# EAGLE design esp8266-01 carrier (EAGLE 9.3.2)
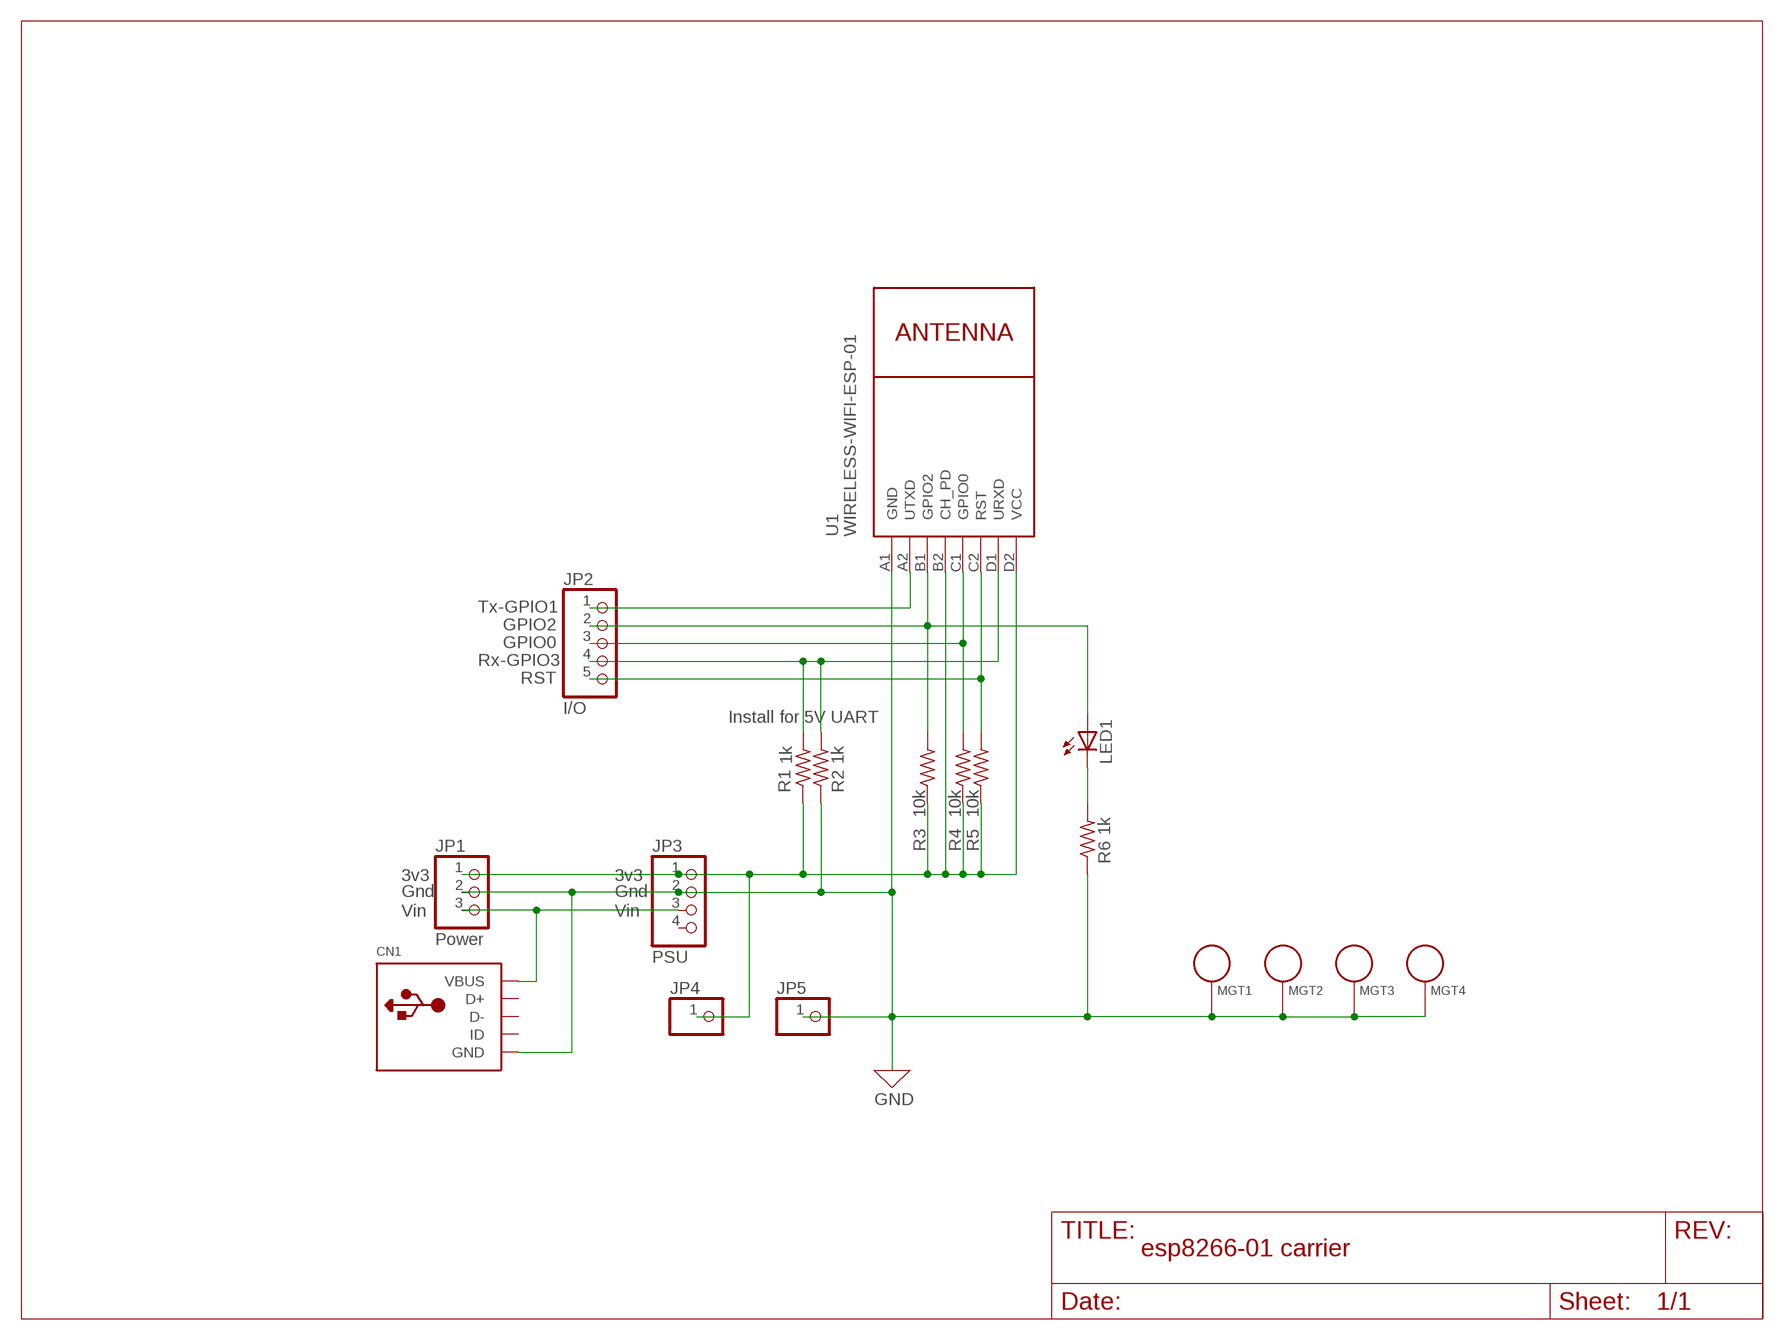
[diagram p0: schematic, sheet 1]

## Parts
CN1  USBTHM  [USB-MINIB-THM]
JP1  Power  PINHD-1X3  [1X03]
JP2  I/O  PINHD-1X5  [1X05]
JP3  PSU  PINHD-1X4  [1X04]
JP4  PINHD-1X1  [1X01]
JP5  PINHD-1X1  [1X01]
LED1  LED5MM  [LED5MM]
MGT1  BEAGLEBONEBLACK_MOUNTING_HOLE  [BEAGLEBONEBLACK_MOUNTING_HOLE]
MGT2  BEAGLEBONEBLACK_MOUNTING_HOLE  [BEAGLEBONEBLACK_MOUNTING_HOLE]
MGT3  BEAGLEBONEBLACK_MOUNTING_HOLE  [BEAGLEBONEBLACK_MOUNTING_HOLE]
MGT4  BEAGLEBONEBLACK_MOUNTING_HOLE  [BEAGLEBONEBLACK_MOUNTING_HOLE]
R1  1k  R-US_0207/10  [0207/10]
R2  1k  R-US_0207/10  [0207/10]
R3  10k  R-US_0207/10  [0207/10]
R4  10k  R-US_0207/10  [0207/10]
R5  10k  R-US_0207/10  [0207/10]
R6  1k  R-US_0207/10  [0207/10]
U1  WIRELESS-WIFI-ESP-01  [WIRELESS-WIFI-ESP-01]

## Nets
3V3: JP1.1 JP3.1 JP4.1 R1.1 R3.1 R4.1 R5.1 U1.B2(CH_PD) U1.D2(VCC)
GND: CN1.GND JP1.2 JP3.2 JP5.1 MGT1.P$1 MGT2.P$1 MGT3.P$1 MGT4.P$1 R2.1 R6.1 U1.A1(GND)
N$1: LED1.K(C) R6.2
N$2: JP2.2 LED1.A R3.2 U1.B1(GPIO2)
N$3: CN1.VBUS JP1.3 JP3.3
N$4: JP2.3 R4.2 U1.C1(GPIO0)
N$5: JP2.5 R5.2 U1.C2(RST)
N$6: JP2.4 R1.2 R2.2 U1.D1(URXD)
TX-GPIO1: JP2.1 U1.A2(UTXD)
Unconnected: CN1.D+ CN1.D- CN1.ID JP3.4

## Notes on the sheet
- Tx-GPIO1
- GPIO2
- GPIO0
- Rx-GPIO3
- RST
- Install for 5V UART
- 3v3 | 3v3
- Gnd | Gnd
- Vin | Vin

## Library data of the parts
CN1 = adafruit:USB: USB Connectors USBMINIB - Surface Mount Female Mini-B USB Connector 4UConnector: 06564 By microbuilder.eu Thru-hole RA Female Mini-B USB Connector 4UConnector: 18732 By ladyada.net
JP1 = pinhead:PINHD-1X3: PIN HEADER
JP2 = pinhead:PINHD-1X5: PIN HEADER
JP3 = pinhead:PINHD-1X4: PIN HEADER
JP4 JP5 = adafruit:PINHD-1X1: Pin header 1x1 for 0.1" spacing With round pins
LED1 = adafruit:LED: LED OSRAM: - CHIPLED LG R971, LG N971, LY N971, LG Q971, LY Q971, LO R971, LY R971 LH N974, LH R974 LS Q976, LO Q976, LY Q976 LO Q996 - Hyper CHIPLED LW Q18S LB Q993, LB Q99A, LB R99A - SideLED LS A670, LO A670, LY A670, LG A670, LP A670 LB A673, LV A673, LT A673, LW A673 LH A674 LY A675 LS A676, LA A676, LO A676, LY A676, LW A676 LS A679, LY A679, LG A679 - Hyper Micro SIDELED® LS Y876, LA Y876, LO Y876, LY Y876 LT Y87S - SmartLED LW L88C, LW L88S LB L89C, LB L89S, LG L890 LS L89K, LO L89K, LY L89K LS L896, LA L896, LO L896, LY L896 - TOPLED LS T670, LO T670, LY T670, LG T670, LP T670 LSG T670, LSP T670, LSY T670, LOP T670, LYG T670 LG T671, LOG T671, LSG T671 LB T673, LV T673, LT T673, LW T673 LH T674 LS T676, LA T676, LO T676, LY T676, LB T676, LH T676, LSB T676, LW T676 LB T67C, LV T67C, LT T67C, LS T67K, LO T67K, LY T67K, LW E67C LS E67B, LA E67B, LO E67B, LY E67B, LB E67C, LV E67C, LT E67C LW T67C LS T679, LY T679, LG T679 LS T770, LO T770, LY T770, LG T770, LP T770 LB T773, LV T773, LT T773, LW T773 LH T774 LS E675, LA E675, LY E675, LS T675 LS T776, LA T776, LO T776, LY T776, LB T776 LHGB T686 LT T68C, LB T68C - Hyper Mini TOPLED® LB M676 - Mini TOPLED Santana® LG M470 LS M47K, LO M47K, LY M47K Source: http://www.osram.convergy.de/
MGT1-MGT4 = BeagleBone_Black_Wireless:BEAGLEBONEBLACK_MOUNTING_HOLE: Chassis Mounting Hole w/GND connection ability
R1-R6 = BeagleBone_Black_Wireless:R-US_: RESISTOR, American symbol
U1 = diy-modules:WIRELESS-WIFI-ESP-01: Wireless Wi-Fi ESP-01 Module based on ESP8266 chip Click here to find device on ebay.com <http://www.ebay.com/sch/esp8266+esp+01+transceiver>

## Board
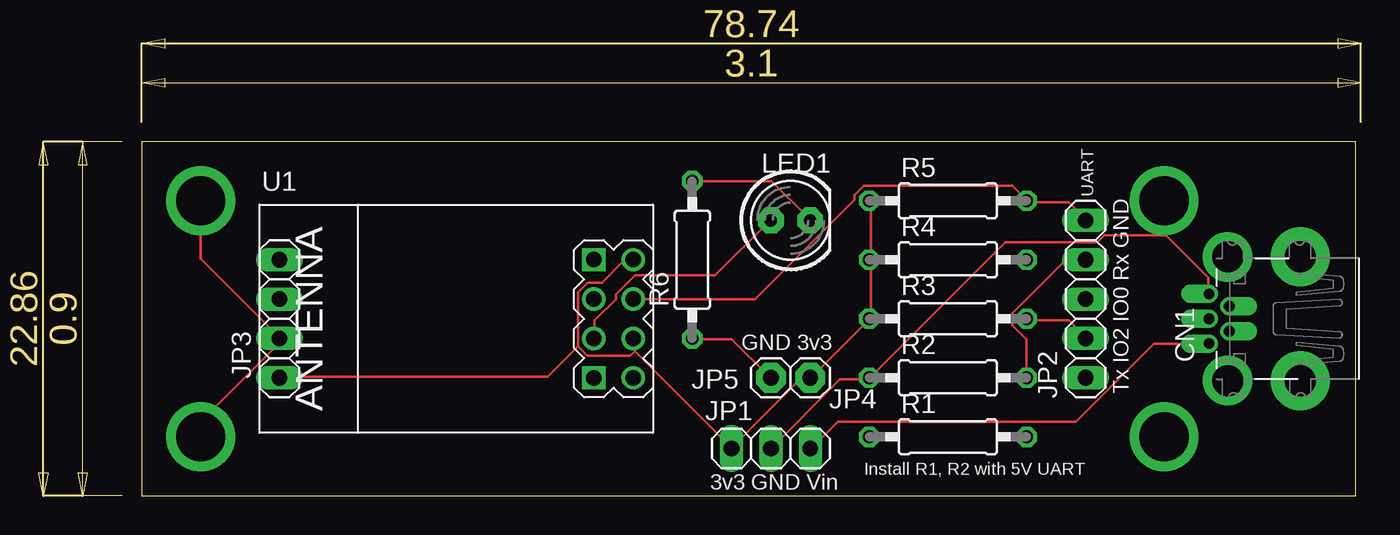
[diagram p1: board, top side]
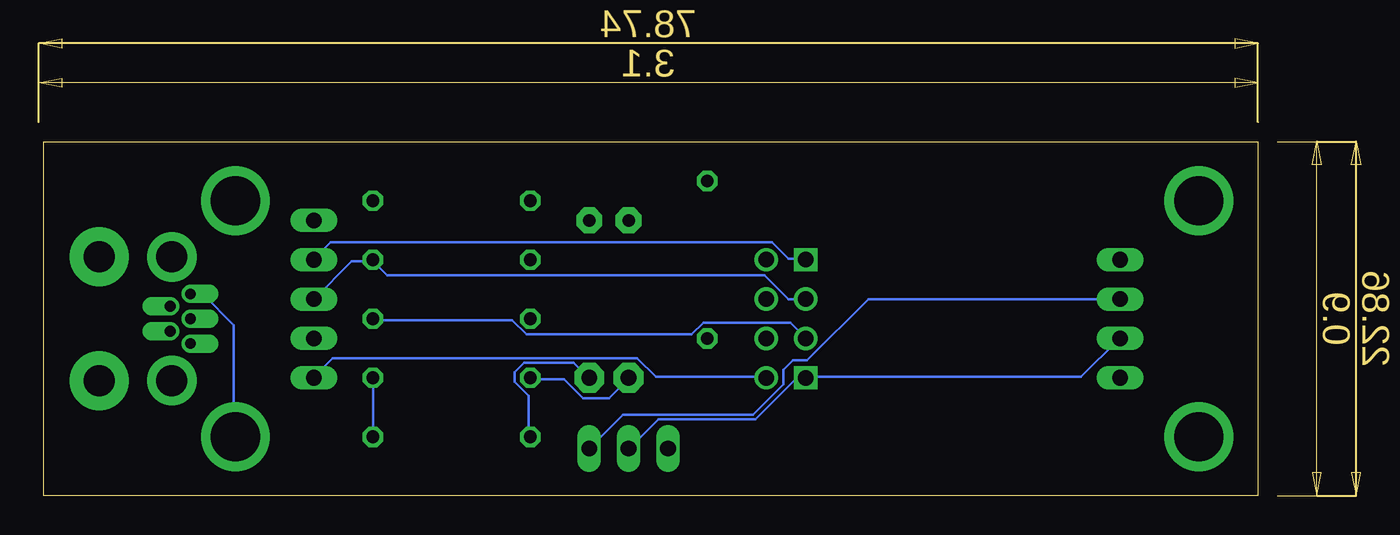
[diagram p2: board, bottom side, seen from below]

Size 78.41 x 22.85 mm. Coordinates in mm from the lower left corner, seen from the top.
Outline: 0,0 78.41,0 78.41,22.85 0,22.85 0,0
Copper layers (1*16): Top 0.035mm / dielectric 1.5mm / Bottom 0.035mm
Design rules "default": minimum track width 6mil, minimum drill 0.35mm, track to track 6mil, track to pad 6mil, pad to pad 6mil, via to via 6mil, smd to smd 6mil, copper to edge 40mil, drill to drill 6mil, minimum pad ring 10mil, minimum via ring 8mil, stop-mask expansion 4mil, vias tented up to drill 0mil, thermal gap 10mil

### Footprints (pad centres in the part's own frame; a part is rotated, then mirrored left to right if it is on the bottom)
USB-MINIB-THM = drill 0.7 offset: D+ 0,9.8; D- -0.8,8.5; GND 1.6,9.8; ID 0.8,8.5; VBUS -1.6,9.8 | drill 2 pad 3.81: GND1 -4,3.9; GND4 4,3.9 | drill 2 pad 3.2: GND2 -4,8.6; GND3 4,8.6
1X03 = drill 1.016 long: 1 -2.54,0; 2 0,0; 3 2.54,0
1X05 = drill 1.016 long: 1 -5.08,0; 2 -2.54,0; 3 0,0; 4 2.54,0; 5 5.08,0
1X04 = drill 1.016 long: 1 -3.81,0; 2 -1.27,0; 3 1.27,0; 4 3.81,0
1X01 = drill 1.016 pad 1.93 octagon: 1 0,0
LED5MM = drill 0.813 pad 1.676 octagon: A -1.27,0; K 1.27,0
BEAGLEBONEBLACK_MOUNTING_HOLE = drill 3.175 pad 4.445: P$1 0,0
0207/10 = drill 0.813 octagon: 1 -5.08,0; 2 5.08,0
WIRELESS-WIFI-ESP-01 = drill 1 square: A1 -8.89,3.81; D1 -8.89,-3.81 | drill 1: A2 -11.43,3.81; B1 -8.89,1.27; B2 -11.43,1.27; C1 -8.89,-1.27; C2 -11.43,-1.27; D2 -11.43,-3.81

### Placement (x,y rotation side)
CN1  78.74,11.43 90 top
JP1  40.64,3.05 0 top
JP2  60.96,12.7 90 top
JP3  8.89,11.43 90 top
JP4  43.18,7.62 0 top
JP5  40.64,7.62 0 top
LED1  41.91,17.78 0 top
MGT1  3.81,3.81 0 top
MGT2  3.81,19.05 0 top
MGT3  66.04,19.05 0 top
MGT4  66.04,3.81 0 top
R1  52.07,3.81 0 top
R2  52.07,7.62 0 top
R3  52.07,11.43 0 top
R4  52.07,15.24 0 top
R5  52.07,19.05 0 top
R6  35.56,15.24 90 top
U1  20.32,11.43 180 top

### Tracks (layer width: path | path; a pad name or v marks a point on that pad's centre or on a via)
3V3
  Top 0.152: R5.1 47.09,18.95 47.09,15.29 R4.1 47.09,15.14 47.09,11.48 R3.1 46.94,11.33 43.28,7.67 JP4.1 43.13,7.52 42.52,7.52 38.1,3.1 | 31.85,9.35 31.85,10.11 U1.B2 | 38.1,3.1 31.85,9.35 | 28.19,9.65 28.19,13.16 28.8,13.77 29.72,13.77 31.09,15.14 31.7,15.14 U1.D2 | 28.19,9.65 28.8,9.04 31.55,9.04 31.85,9.35 | 28.19,9.65 26.21,7.67 8.99,7.67 JP3.1 | 38.1,3.1 JP1.1
  Bottom 0.152: R1.1 47.09,3.86 47.09,6.45 48.01,7.37 48.01,7.98 47.4,8.59 44.2,8.59 43.28,7.67 JP4.1
GND
  Top 0.152: 66.14,16.82 68.88,14.07 68.88,13.16 CN1.GND | 66.14,16.82 66.14,18.95 MGT3.P$1 | R6.1 35.66,10.11 38.1,10.11 40.54,7.67 JP5.1 | JP1.2 45.11,7.52 46.94,7.52 R2.1 47.09,7.67 55.78,16.36 61.72,16.36 62.18,16.82 66.14,16.82 | MGT1.P$1 3.81,4.78 8.84,9.8 8.84,10.11 JP3.2 8.84,10.26 3.81,15.29 MGT2.P$1
  Bottom 0.152: MGT4.P$1 66.14,3.86 66.14,11.02 68.12,13 68.88,13 CN1.GND | R2.1 46.94,7.52 44.81,7.52 43.59,6.3 41.91,6.3 40.69,7.52 JP5.1 | JP1.2 40.54,3.1 38.71,4.93 32.46,4.93 29.87,7.52 29.26,7.52 U1.A1 29.11,7.67 11.43,7.67 8.99,10.11 JP3.2
N$1
  Top 0.152: R6.2 40.69,20.32 43.13,17.88 LED1.K
N$2
  Top 0.152: R3.2 57.15,11.33 59.89,11.33 60.96,10.26 JP2.2 | U1.B1 29.26,10.26 29.26,11.33 30.63,12.7 30.63,13 31.85,14.22 37.03,14.22 40.54,17.73 LED1.A
  Bottom 0.152: R3.2 57.15,11.33 48.16,11.33 47.24,10.41 36.58,10.41 35.81,11.18 30.18,11.18 29.26,10.26 U1.B1
N$3
  Top 0.152: CN1.VBUS 68.88,9.8 65.38,9.8 60.35,4.78 44.96,4.78 43.28,3.1 JP1.3
  Bottom 0.152: JP3.3 25.15,12.7 29.11,8.74 30.02,8.74 30.63,8.13 30.63,7.21 32.61,5.23 41,5.23 JP1.3
N$4
  Bottom 0.152: 57.15,15.14 58.52,15.14 JP2.3 | U1.C1 30.33,12.7 31.85,14.22 56.24,14.22 57.15,15.14 | 57.15,15.14 R4.2
N$5
  Top 0.152: JP2.5 60.96,17.88 59.89,18.95 57.15,18.95 R5.2 57.15,19.1 56.24,20.02 46.63,20.02 46.02,19.41 46.02,19.1 39.62,12.7 U1.C2
N$6
  Top 0.152: R2.2 57.15,10.11 56.24,11.02 56.24,11.79 59.59,15.14 60.96,15.14 JP2.4
  Bottom 0.152: R2.2 R1.2 | U1.D1 29.26,15.29 30.33,15.29 31.39,16.36 59.89,16.36 60.96,15.29 JP2.4
TX-GPIO1
  Bottom 0.152: U1.A2 31.85,7.67 38.86,7.67 40.08,8.89 59.74,8.89 60.96,7.67 JP2.1

### Text on the board
tNames: UART | GND 3v3 | Tx IO2 IO0 Rx GND | Install R1, R2 with 5V UART | 3v3 GND Vin